# EasyEDA Pro project Kerbal Controller.eprj, schematic Schematic1
Create Date: 2023-06-25; Page Name: P1; Project Name: Kerbal Controller; Schematic Name: Schematic1; Update Date: 2023-07-01; Company: EasyEDA.com; Drawed: EasyEDA Pro; Page Size: A4; Part Number: JLCPCB-002; Reviewed: EasyEDA Pro; Version: V0.1
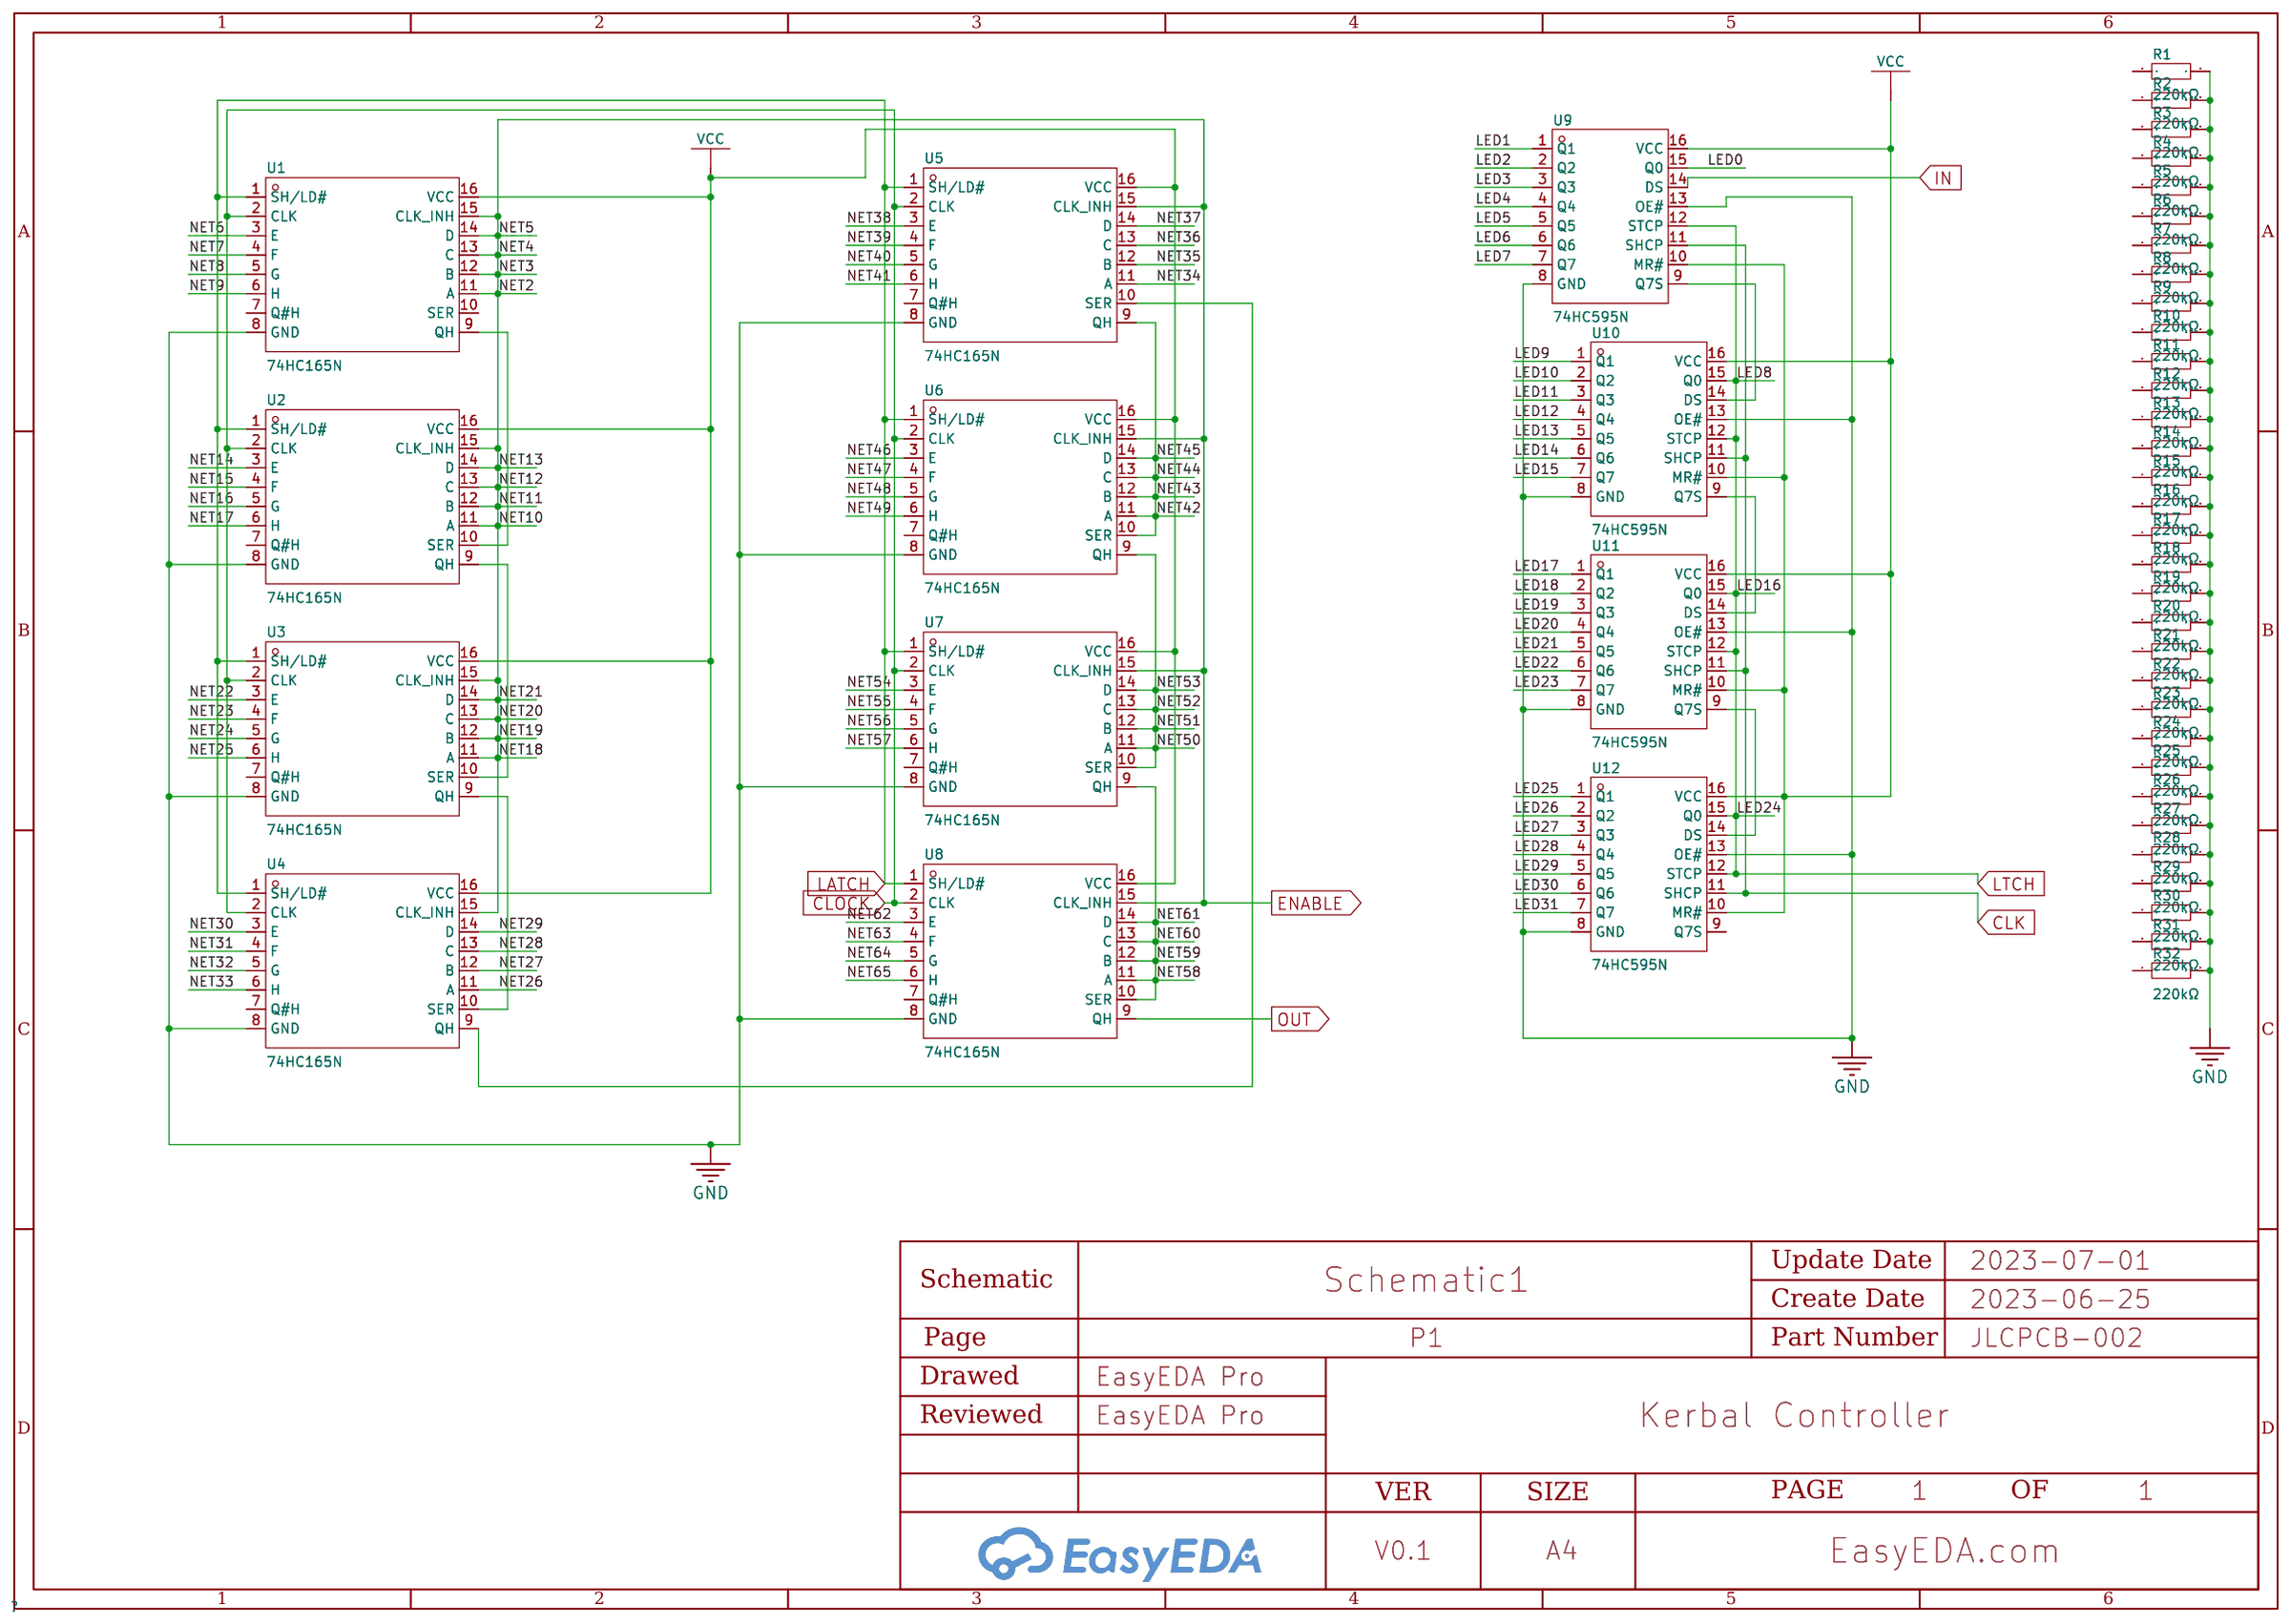
[diagram p0: schematic sheet]

## Parts
R1  220kΩ  [RES-TH_BD2.7-L6.2-P10.20-D0.4]
R2  220kΩ  [RES-TH_BD2.7-L6.2-P10.20-D0.4]
R3  220kΩ  [RES-TH_BD2.7-L6.2-P10.20-D0.4]
R4  220kΩ  [RES-TH_BD2.7-L6.2-P10.20-D0.4]
R5  220kΩ  [RES-TH_BD2.7-L6.2-P10.20-D0.4]
R6  220kΩ  [RES-TH_BD2.7-L6.2-P10.20-D0.4]
R7  220kΩ  [RES-TH_BD2.7-L6.2-P10.20-D0.4]
R8  220kΩ  [RES-TH_BD2.7-L6.2-P10.20-D0.4]
R9  220kΩ  [RES-TH_BD2.7-L6.2-P10.20-D0.4]
R10  220kΩ  [RES-TH_BD2.7-L6.2-P10.20-D0.4]
R11  220kΩ  [RES-TH_BD2.7-L6.2-P10.20-D0.4]
R12  220kΩ  [RES-TH_BD2.7-L6.2-P10.20-D0.4]
R13  220kΩ  [RES-TH_BD2.7-L6.2-P10.20-D0.4]
R14  220kΩ  [RES-TH_BD2.7-L6.2-P10.20-D0.4]
R15  220kΩ  [RES-TH_BD2.7-L6.2-P10.20-D0.4]
R16  220kΩ  [RES-TH_BD2.7-L6.2-P10.20-D0.4]
R17  220kΩ  [RES-TH_BD2.7-L6.2-P10.20-D0.4]
R18  220kΩ  [RES-TH_BD2.7-L6.2-P10.20-D0.4]
R19  220kΩ  [RES-TH_BD2.7-L6.2-P10.20-D0.4]
R20  220kΩ  [RES-TH_BD2.7-L6.2-P10.20-D0.4]
R21  220kΩ  [RES-TH_BD2.7-L6.2-P10.20-D0.4]
R22  220kΩ  [RES-TH_BD2.7-L6.2-P10.20-D0.4]
R23  220kΩ  [RES-TH_BD2.7-L6.2-P10.20-D0.4]
R24  220kΩ  [RES-TH_BD2.7-L6.2-P10.20-D0.4]
R25  220kΩ  [RES-TH_BD2.7-L6.2-P10.20-D0.4]
R26  220kΩ  [RES-TH_BD2.7-L6.2-P10.20-D0.4]
R27  220kΩ  [RES-TH_BD2.7-L6.2-P10.20-D0.4]
R28  220kΩ  [RES-TH_BD2.7-L6.2-P10.20-D0.4]
R29  220kΩ  [RES-TH_BD2.7-L6.2-P10.20-D0.4]
R30  220kΩ  [RES-TH_BD2.7-L6.2-P10.20-D0.4]
R31  220kΩ  [RES-TH_BD2.7-L6.2-P10.20-D0.4]
R32  220kΩ  [RES-TH_BD2.7-L6.2-P10.20-D0.4]
U1  74HC165N  [DIP-16_L20.0-W6.4-P2.54-LS7.6-BL]
U2  74HC165N  [DIP-16_L20.0-W6.4-P2.54-LS7.6-BL]
U3  74HC165N  [DIP-16_L20.0-W6.4-P2.54-LS7.6-BL]
U4  74HC165N  [DIP-16_L20.0-W6.4-P2.54-LS7.6-BL]
U5  74HC165N  [DIP-16_L20.0-W6.4-P2.54-LS7.6-BL]
U6  74HC165N  [DIP-16_L20.0-W6.4-P2.54-LS7.6-BL]
U7  74HC165N  [DIP-16_L20.0-W6.4-P2.54-LS7.6-BL]
U8  74HC165N  [DIP-16_L20.0-W6.4-P2.54-LS7.6-BL]
U9  74HC595N  [DIP-16_L20.0-W6.4-P2.54-LS7.6-BL]
U10  74HC595N  [DIP-16_L20.0-W6.4-P2.54-LS7.6-BL]
U11  74HC595N  [DIP-16_L20.0-W6.4-P2.54-LS7.6-BL]
U12  74HC595N  [DIP-16_L20.0-W6.4-P2.54-LS7.6-BL]

## Library data of the parts
R1-R32 = MO1/4W-220K±5%-ST52: Type:Metal Oxide Resistors Resistance: Tolerance:±5% Tolerance:±5% Temperature Coefficient:±350ppm/℃ Temperature Coefficient:±350ppm/℃ Overload Voltage (Max):250V Operating Temperature Range:-55℃~+155℃ Operating Temperature Range:-55℃~+155℃; LCSC Part Name: 金属氧化膜电阻 220kΩ ±5%; Supplier Part: C2857428; Manufacturer: VO(翔胜); Supplier Footprint: 插件,2.7x6.2mm; JLCPCB Part Class: Extended Part; Supplier: LCSC; Type: Metal Oxide Resistors; Tolerance: ±5%; Temperature Coefficient: ±350ppm/℃; Overload Voltage (Max): 250V; Operating Temperature Range: -55℃~+155℃
U1-U8 = 74HC165N: Series: Logic Type: Output Type: Function:; LCSC Part Name: 8 位并联负载移位寄存器; Supplier Part: C507183; Manufacturer: HGSEMI(华冠); Supplier Footprint: DIP-16; JLCPCB Part Class: Extended Part; Datasheet: https://atta.szlcsc.com/upload/public/pdf/source/20200402/C507183_AB61E090E35505290B7903FDF3A1B7D3.pdf; Supplier: LCSC
U9-U12 = 74HC595N_C507175: Series: Logic Type: Output Type: Function:; LCSC Part Name: 具有三态输出寄存器的 8 位移位寄存器; Supplier Part: C507175; Manufacturer: HGSEMI(华冠); Supplier Footprint: DIP-16; JLCPCB Part Class: Extended Part; Datasheet: https://atta.szlcsc.com/upload/public/pdf/source/20221114/A4A3B542E2A1775EA60B9CE5BF9FF01B.pdf; Supplier: LCSC

## Nets
GND: R1.2 R2.2 R3.2 R4.2 R5.2 R6.2 R7.2 R8.2 R9.2 R10.2 R11.2 R12.2 R13.2 R14.2 R15.2 R16.2 R17.2 R18.2 R19.2 R20.2 R21.2 R22.2 R23.2 R24.2 R25.2 R26.2 R27.2 R28.2 R29.2 R30.2 R31.2 R32.2 U1.8(GND) U2.8(GND) U3.8(GND) U4.8(GND) U5.8(GND) U6.8(GND) U7.8(GND) U8.8(GND) U9.8(GND) U9.13(OE#) U10.8(GND) U10.13(OE#) U11.8(GND) U11.13(OE#) U12.8(GND) U12.13(OE#)
VCC: U1.16(VCC) U2.16(VCC) U3.16(VCC) U4.16(VCC) U5.16(VCC) U6.16(VCC) U7.16(VCC) U8.16(VCC) U9.10(MR#) U9.16(VCC) U10.10(MR#) U10.16(VCC) U11.10(MR#) U11.16(VCC) U12.10(MR#) U12.16(VCC)
CLK: U9.11(SHCP) U10.11(SHCP) U11.11(SHCP) U12.11(SHCP)
CLOCK: U1.2(CLK) U2.2(CLK) U3.2(CLK) U4.2(CLK) U5.2(CLK) U6.2(CLK) U7.2(CLK) U8.2(CLK)
ENABLE: U1.15(CLK_INH) U2.15(CLK_INH) U3.15(CLK_INH) U4.15(CLK_INH) U5.15(CLK_INH) U6.15(CLK_INH) U7.15(CLK_INH) U8.15(CLK_INH)
IN: U9.14(DS)
LATCH: U1.1(SH/LD#) U2.1(SH/LD#) U3.1(SH/LD#) U4.1(SH/LD#) U5.1(SH/LD#) U6.1(SH/LD#) U7.1(SH/LD#) U8.1(SH/LD#)
LED0: U9.15(Q0)
LED1: U9.1(Q1)
LED2: U9.2(Q2)
LED3: U9.3(Q3)
LED4: U9.4(Q4)
LED5: U9.5(Q5)
LED6: U9.6(Q6)
LED7: U9.7(Q7)
LED8: U10.15(Q0)
LED9: U10.1(Q1)
LED10: U10.2(Q2)
LED11: U10.3(Q3)
LED12: U10.4(Q4)
LED13: U10.5(Q5)
LED14: U10.6(Q6)
LED15: U10.7(Q7)
LED16: U11.15(Q0)
LED17: U11.1(Q1)
LED18: U11.2(Q2)
LED19: U11.3(Q3)
LED20: U11.4(Q4)
LED21: U11.5(Q5)
LED22: U11.6(Q6)
LED23: U11.7(Q7)
LED24: U12.15(Q0)
LED25: U12.1(Q1)
LED26: U12.2(Q2)
LED27: U12.3(Q3)
LED28: U12.4(Q4)
LED29: U12.5(Q5)
LED30: U12.6(Q6)
LED31: U12.7(Q7)
LTCH: U9.12(STCP) U10.12(STCP) U11.12(STCP) U12.12(STCP)
NET2: U1.11(A)
NET3: U1.12(B)
NET4: U1.13(C)
NET5: U1.14(D)
NET6: U1.3(E)
NET7: U1.4(F)
NET8: U1.5(G)
NET9: U1.6(H)
NET10: U2.11(A)
NET11: U2.12(B)
NET12: U2.13(C)
NET13: U2.14(D)
NET14: U2.3(E)
NET15: U2.4(F)
NET16: U2.5(G)
NET17: U2.6(H)
NET18: U3.11(A)
NET19: U3.12(B)
NET20: U3.13(C)
NET21: U3.14(D)
NET22: U3.3(E)
NET23: U3.4(F)
NET24: U3.5(G)
NET25: U3.6(H)
NET26: U4.11(A)
NET27: U4.12(B)
NET28: U4.13(C)
NET29: U4.14(D)
NET30: U4.3(E)
NET31: U4.4(F)
NET32: U4.5(G)
NET33: U4.6(H)
NET34: U5.11(A)
NET35: U5.12(B)
NET36: U5.13(C)
NET37: U5.14(D)
NET38: U5.3(E)
NET39: U5.4(F)
NET40: U5.5(G)
NET41: U5.6(H)
NET42: U6.11(A)
NET43: U6.12(B)
NET44: U6.13(C)
NET45: U6.14(D)
NET46: U6.3(E)
NET47: U6.4(F)
NET48: U6.5(G)
NET49: U6.6(H)
NET50: U7.11(A)
NET51: U7.12(B)
NET52: U7.13(C)
NET53: U7.14(D)
NET54: U7.3(E)
NET55: U7.4(F)
NET56: U7.5(G)
NET57: U7.6(H)
NET58: U8.11(A)
NET59: U8.12(B)
NET60: U8.13(C)
NET61: U8.14(D)
NET62: U8.3(E)
NET63: U8.4(F)
NET64: U8.5(G)
NET65: U8.6(H)
OUT: U8.9(QH)
$1N2794: U1.9(QH) U2.10(SER)
$1N2813: U2.9(QH) U3.10(SER)
$1N2832: U3.9(QH) U4.10(SER)
$1N2851: U4.9(QH) U5.10(SER)
$1N2871: U5.9(QH) U6.10(SER)
$1N2890: U6.9(QH) U7.10(SER)
$1N2909: U7.9(QH) U8.10(SER)
$1N5175: U10.9(Q7S) U11.14(DS)
$1N5215: U11.9(Q7S) U12.14(DS)
$1N10708: U9.9(Q7S) U10.14(DS)

Not connected (* = marked no-connect by the designer): R1 1; R2 1; R3 1; R4 1; R5 1; R6 1; R7 1; R8 1; R9 1; R10 1; R11 1; R12 1; R13 1; R14 1; R15 1; R16 1; R17 1; R18 1; R19 1; R20 1; R21 1; R22 1; R23 1; R24 1; R25 1; R26 1; R27 1; R28 1; R29 1; R30 1; R31 1; R32 1; U1 7(Q#H) 10(SER); U2 7(Q#H); U3 7(Q#H); U4 7(Q#H); U5 7(Q#H); U6 7(Q#H); U7 7(Q#H); U8 7(Q#H); U12 9(Q7S)
